# Altium schematic sheet Roseta_AC.SchDoc
size A4
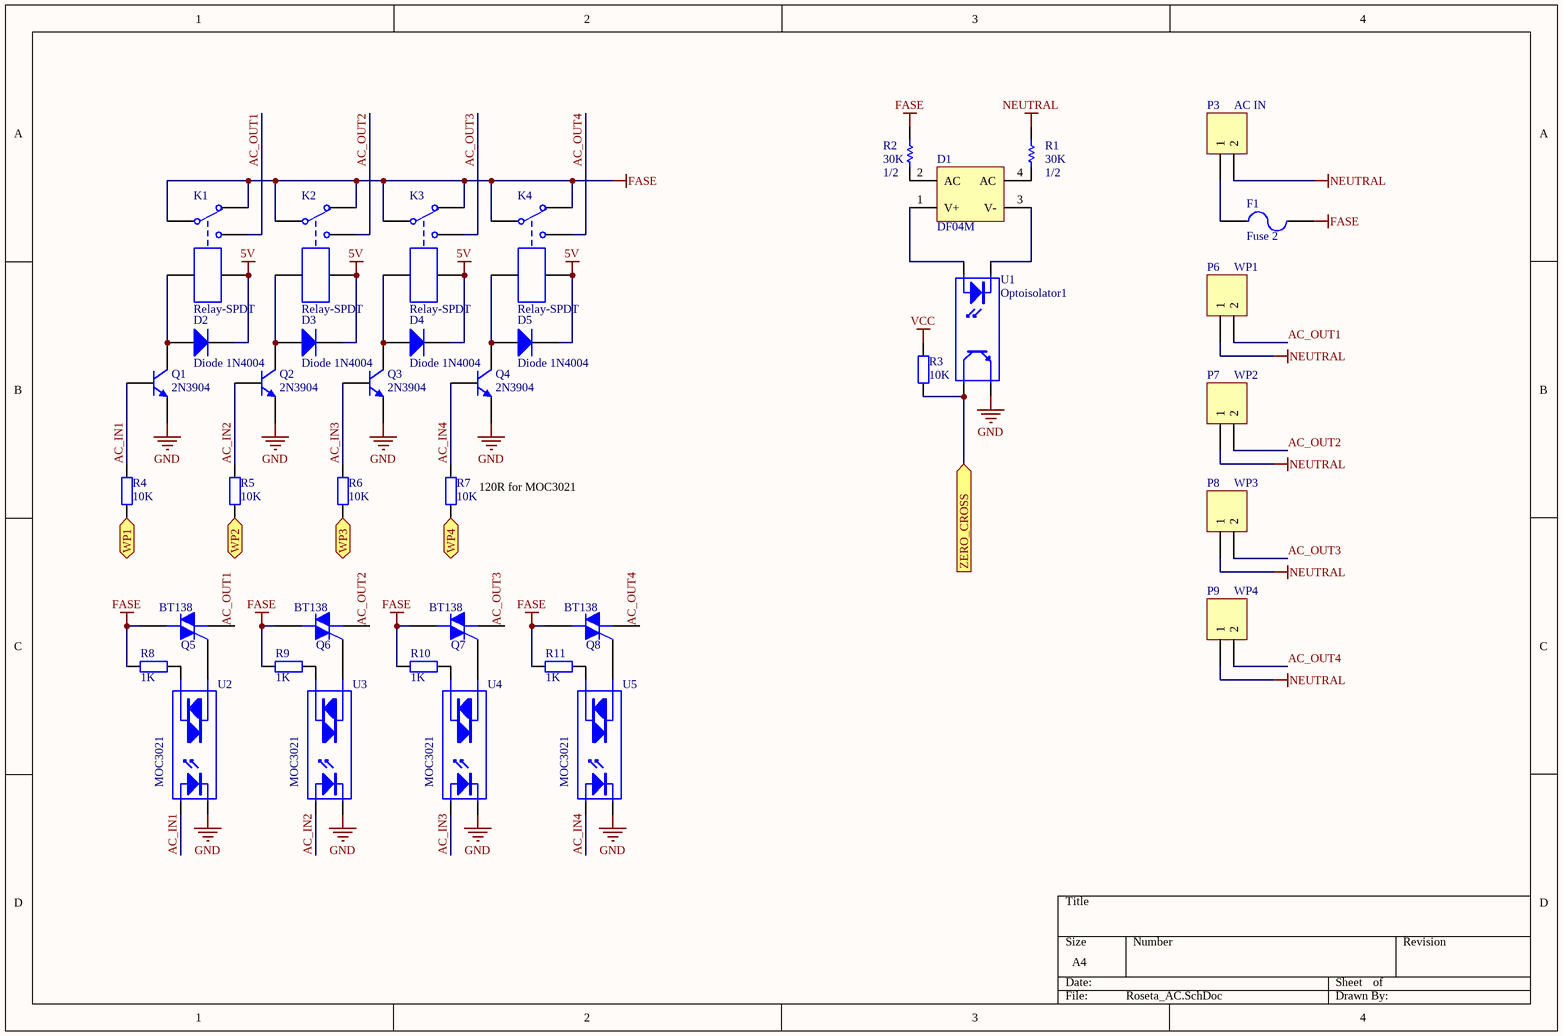
[diagram p0: Roseta_AC.SchDoc]

## Parts
D1  DF04M  [DF04M]
D2  Diode 1N4004  [1n4007]
D3  Diode 1N4004  [1n4007]
D4  Diode 1N4004  [1n4007]
D5  Diode 1N4004  [1n4007]
F1  Fuse 2  [PIN-W2/E2.8]
K1  Relay-SPDT  [RELAY-HRS4]
K2  Relay-SPDT  [RELAY-HRS4]
K3  Relay-SPDT  [RELAY-HRS4]
K4  Relay-SPDT  [RELAY-HRS4]
P3  AC IN  [TERMINAL BLOCK X2]
P6  WP1  [TERMINAL BLOCK X2]
P7  WP2  [TERMINAL BLOCK X2]
P8  WP3  [TERMINAL BLOCK X2]
P9  WP4  [TERMINAL BLOCK X2]
Q1  2N3904  [BCY-W3/E4]
Q2  2N3904  [BCY-W3/E4]
Q3  2N3904  [BCY-W3/E4]
Q4  2N3904  [BCY-W3/E4]
Q5  BT138  [221A-09]
Q6  BT138  [221A-09]
Q7  BT138  [221A-09]
Q8  BT138  [221A-09]
R1  1/2  value 30K  [AXIAL-0.3]
R2  1/2  value 30K  [AXIAL-0.3]
R3  value 10K  [1608[0603]]  (hidden comment: Res2)
R4  value 10K  [1608[0603]]  (hidden comment: Res2)
R5  value 10K  [1608[0603]]  (hidden comment: Res2)
R6  value 10K  [1608[0603]]  (hidden comment: Res2)
R7  value 10K  [1608[0603]]  (hidden comment: Res2)
R8  value 1K  [1608[0603]]  (hidden comment: Res2)
R9  value 1K  [1608[0603]]  (hidden comment: Res2)
R10  value 1K  [1608[0603]]  (hidden comment: Res2)
R11  value 1K  [1608[0603]]  (hidden comment: Res2)
U1  Optoisolator1  [DIP-6]
U2  MOC3021  [DIP-6]
U3  MOC3021  [DIP-6]
U4  MOC3021  [DIP-6]
U5  MOC3021  [DIP-6]

## Ports
WP1 (in), WP2 (in), WP3 (in), WP4 (in), ZERO_CROSS (in)

## Nets
5V: D2.2(K) D3.2(K) D4.2(K) D5.2(K) K1.5 K2.5 K3.5 K4.5
FASE: F1.1 K1.1 K1.2 K2.1 K2.2 K3.1 K3.2 K4.1 K4.2 Q5.2(M2) Q6.2(M2) Q7.2(M2) Q8.2(M2) R2.2 R8.2 R9.2 R10.2 R11.2
GND: Q1.1(E) Q2.1(E) Q3.1(E) Q4.1(E) U1.3(E) U2.2(K) U3.2(K) U4.2(K) U5.2(K)
NEUTRAL: P3.2 P6.1 P7.1 P8.1 P9.1 R1.2
VCC: R3.1
AC_IN1: Q1.2(B) R4.2 U2.1(A)
AC_IN2: Q2.2(B) R5.2 U3.1(A)
AC_IN3: Q3.2(B) R6.2 U4.1(A)
AC_IN4: Q4.2(B) R7.2 U5.1(A)
AC_OUT1: K1.3 P6.2 Q5.1(M1)
AC_OUT2: K2.3 P7.2 Q6.1(M1)
AC_OUT3: K3.3 P8.2 Q7.1(M1)
AC_OUT4: K4.3 P9.2 Q8.1(M1)
WP1: R4.1 ; port WP1
WP2: R5.1 ; port WP2
WP3: R6.1 ; port WP3
WP4: R7.1 ; port WP4
ZERO_CROSS: R3.2 U1.4(C) ; port ZERO_CROSS
NetD1_1: D1.1(V+) U1.1(A)
NetD1_2: D1.2(AC) R2.1
NetD1_3: D1.3(V-) U1.2(K)
NetD1_4: D1.4(AC) R1.1
NetD2_1: D2.1(A) K1.4 Q1.3(C)
NetD3_1: D3.1(A) K2.4 Q2.3(C)
NetD4_1: D4.1(A) K3.4 Q3.3(C)
NetD5_1: D5.1(A) K4.4 Q4.3(C)
NetF1_2: F1.2 P3.1
NetQ5_3: Q5.3(G) U2.4(A/K)
NetQ6_3: Q6.3(G) U3.4(A/K)
NetQ7_3: Q7.3(G) U4.4(A/K)
NetQ8_3: Q8.3(G) U5.4(A/K)
NetR8_1: R8.1 U2.3(A/K)
NetR9_1: R9.1 U3.3(A/K)
NetR10_1: R10.1 U4.3(A/K)
NetR11_1: R11.1 U5.3(A/K)

## Notes on the sheet
- (near R7) 120R for MOC3021

## Library data of the parts
D1 = Bridge2: Diode Bridge; Published: 24-Mar-1999; LatestRevisionDate: 17-Jul-2002; LatestRevisionNote: Re-released for DXP Platform.; PackageReference: D-46_6A; Publisher: Altium Limited
D2-D5 = Diode 1N4004: 1 Amp General Purpose Rectifier; Published: 8-Jun-2000; LatestRevisionDate: 17-Jul-2002; LatestRevisionNote: Re-released for DXP Platform.; DatasheetVersion: 1998; PackageVersion: Aug-1999; PackageReference: DO-41; Publisher: Altium Limited; Code_JEDEC: DO-204-AL; ComponentLink1Description: Manufacturer Link; ComponentLink1URL: http://www.fairchildsemi.com/; ComponentLink2Description: Datasheet; ComponentLink2URL: http://www.fairchildsemi.com/ds/1N%2F1N4001.pdf
F1 = Fuse 2: Fuse; Published: 8-Jun-2000; LatestRevisionDate: 17-Jul-2002; LatestRevisionNote: Re-released for DXP Platform.; PackageReference: PIN-W2/E2.8; Publisher: Altium Limited
K1-K4 = Relay-SPDT: Single-Pole Dual-Throw Relay; Published: 24-Mar-1999; LatestRevisionDate: 17-Jul-2002; LatestRevisionNote: Re-released for DXP Platform.; PackageReference: MODULE5B; Publisher: Altium Limited
P3 P6-P9 = Header 2: Header, 2-Pin; LatestRevisionDate: 17-Jul-2002; LatestRevisionNote: Re-released for DXP Platform.; Publisher: Altium Limited
Q1-Q4 = 2N3904: NPN General Purpose Amplifier; Published: 8-Jun-2000; LatestRevisionDate: 15-Jan-2003; LatestRevisionNote: PCB Footprint 'BCY-W3/D4.7' replaced; DatasheetVersion: 1997; PackageVersion: Sep-1998; PackageReference: TO-92A; Publisher: Altium Limited; Code_JEDEC: TO-92A; ComponentLink1Description: Manufacturer Link; ComponentLink1URL: http://www.fairchildsemi.com/; ComponentLink2Description: Datasheet; ComponentLink2URL: http://www.fairchildsemi.com/ds/2N%2F2N3904.pdf
Q5-Q8 = MAC15A6: Silicon Bidirectional Triode Thyristor; Note: Pin 2 is electrically connected to Pin 4 (TAB); Published: 29-Sep-2000; LatestRevisionDate: 17-Jul-2002; LatestRevisionNote: Re-released for DXP Platform.; DatasheetVersion: 1999; PackageVersion: 1997; PackageReference: 221A-09; Publisher: Altium Limited; PackageDescription: TO, Thru-Hole, Vertical, Heatsink Mounted; 3 In-Line Leads; Pitch 2.54 mm; Code_JEDEC: TO-262-AA; ComponentLink1Description: Manufacturer Link; ComponentLink1URL: http://www.onsemi.com/site/products/landing?taxonomyID=194; ComponentLink2Description: Datasheet; ComponentLink2URL: http://www.onsemi.com/pub/Collateral/MAC15A4-D.PDF
R1 R2 = Res1: Resistor; Published: 8-Jun-2000; LatestRevisionDate: 17-Jul-2002; LatestRevisionNote: Re-released for DXP Platform.; PackageReference: AXIAL-0.3; Publisher: Altium Limited
R3-R11 = Res2: Resistor; Published: 8-Jun-2000; LatestRevisionDate: 17-Jul-2002; LatestRevisionNote: Re-released for DXP Platform.; PackageReference: AXIAL-0.4; Publisher: Altium Limited
U1 = Optoisolator1: 4-Pin Phototransistor Optocoupler; pin to pad: 3>4 4>5; Published: 24-Mar-1999; LatestRevisionDate: 04-Mar-2005; LatestRevisionNote: Sch pins 3 & 4 Swapped.; DatasheetVersion: Nov-2003; PackageReference: DIP-4; Publisher: Altium Limited
U2-U5 = Opto TRIAC: Opto-Triac; pin to pad: 3>4 4>6; Published: 24-Mar-1999; LatestRevisionDate: 17-Jul-2002; LatestRevisionNote: Re-released for DXP Platform.; PackageReference: NPSIP4A; Publisher: Altium Limited